# Altium schematic sheet CRSC0004.SchDoc: Critical System Computer - Serial
size A3; Engineer: Sam Shan Jiang; DocumentNumber: CRSC0004; SheetNumber: 4; SheetTotal: 5; Description: Serial USB interface chip; Version: 1.0
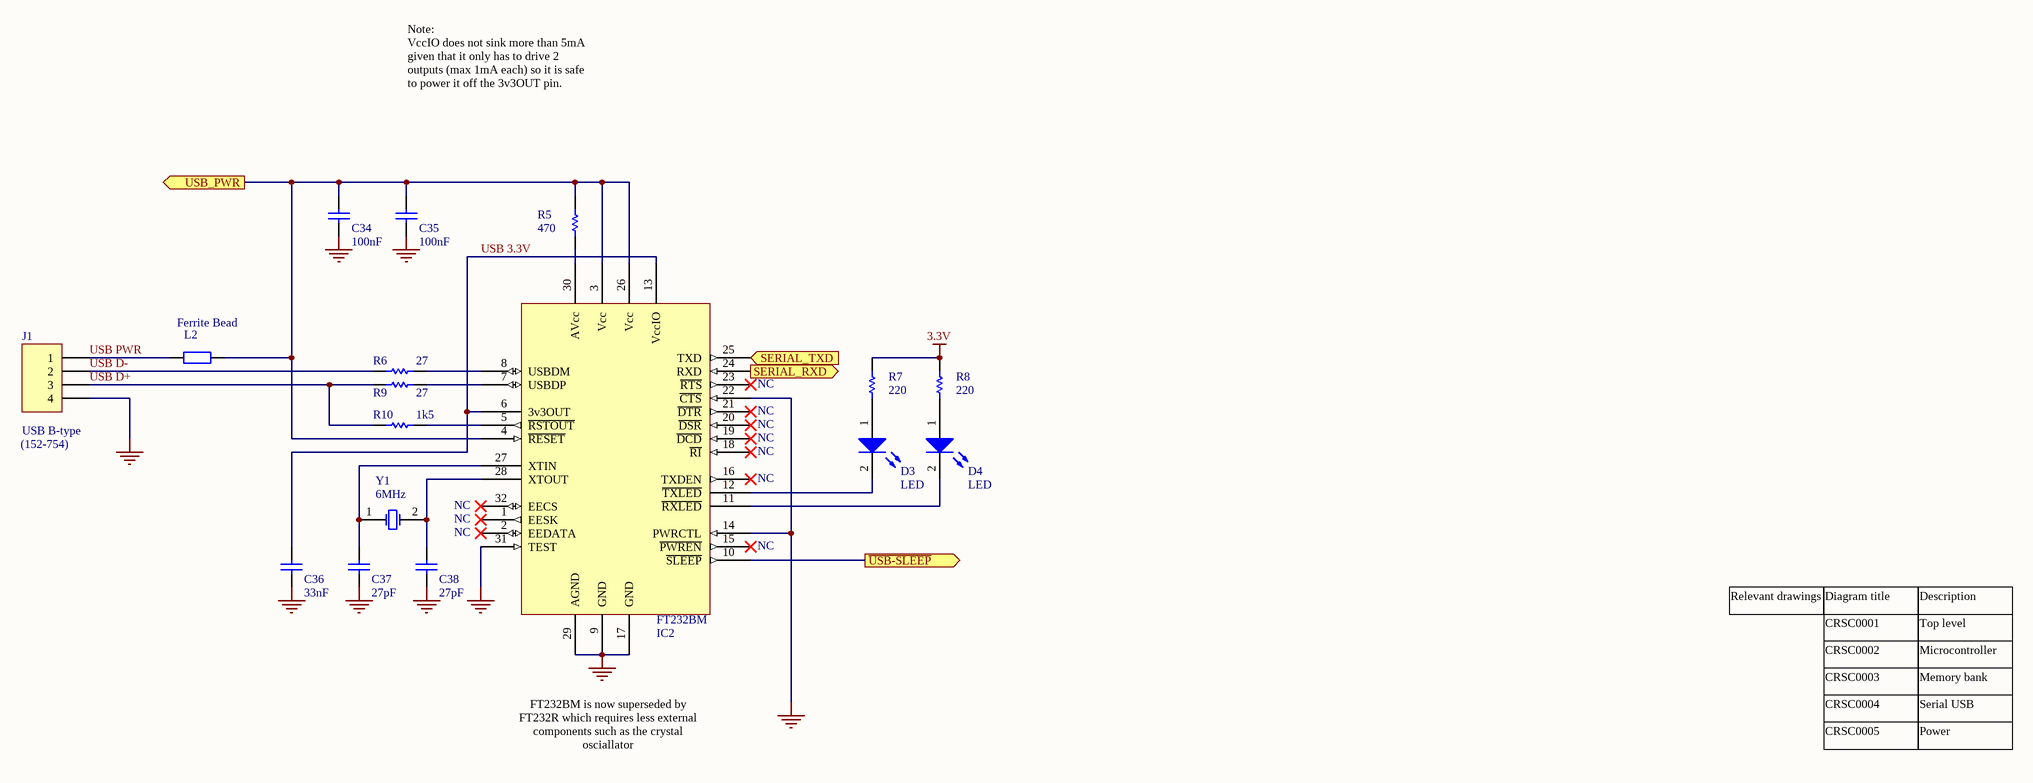
[diagram p0: CRSC0004.SchDoc]

## Parts
C34  100nF  [0805]
C35  100nF  [0805]
C36  33nF  [0805]
C37  27pF  [0805]
C38  27pF  [0805]
D3  LED  [0805]
D4  LED  [0805]
IC2  FT232BM  [FT232BM]
J1  USB B-type  [usb-b]
L2  Ferrite Bead  [AXIAL-0.5]  (value not drawn)
R5  470  [0805]
R6  27  [0805]
R7  220  [0805]
R8  220  [0805]
R9  27  [0805]
R10  1k5  [0805]
Y1  6MHz  [HC49US]

## Ports
SERIAL_RXD (in), SERIAL_TXD (out), USB_PWR (out), ~{USB-SLEEP} (out)

## Nets
3.3V: R7.1 R8.1
GND: C34.2 C35.2 C36.2 C37.2 C38.2 IC2.9(GND) IC2.14(PWRCTL) IC2.17(GND) IC2.22(~{CTS}) IC2.29(AGND) IC2.31(TEST) J1.4
~{USB-SLEEP}: IC2.10(~{SLEEP}) ; port ~{USB-SLEEP}
SERIAL_RXD: IC2.24(RXD) ; port SERIAL_RXD
SERIAL_TXD: IC2.25(TXD) ; port SERIAL_TXD
USB 3.3V: C36.1 IC2.6(3v3OUT) IC2.13(VccIO)
USB D+: J1.3 R9.1 R10.1
USB D-: J1.2 R6.1
USB PWR: J1.1 L2.2
USB_PWR: C34.1 C35.1 IC2.3(Vcc) IC2.4(~{RESET}) IC2.26(Vcc) L2.1 R5.1 ; port USB_PWR
NetC37_1: C37.1 IC2.27(XTIN) Y1.1(OSC1)
NetC38_1: C38.1 IC2.28(XTOUT) Y1.2(OSC2)
NetD3_1: D3.1(A) R7.2
NetD3_2: D3.2(K) IC2.12(~{TXLED})
NetD4_1: D4.1(A) R8.2
NetD4_2: D4.2(K) IC2.11(~{RXLED})
NetIC2_5: IC2.5(~{RSTOUT}) R10.2
NetIC2_7: IC2.7(USBDP) R9.2
NetIC2_8: IC2.8(USBDM) R6.2
NetIC2_30: IC2.30(AVcc) R5.2

Not connected (* = marked no-connect by the designer): IC2 1(EESK)* 2(EEDATA)* 15(~{PWREN})* 16(TXDEN)* 18(~{RI})* 19(~{DCD})* 20(~{DSR})* 21(~{DTR})* 23(~{RTS})* 32(EECS)*

## Notes on the sheet
- Note:
  VccIO does not sink more than 5mA given that it only has to drive 2 outputs (max 1mA each) so it is safe to power it off the 3v3OUT pin.
- (near L2) Ferrite Bead
- (near IC2) NC
- (near J1) (152-754)
- NC
- Relevant drawings
- CRSC0001
- CRSC0002
- Diagram title
- Top level
- Microcontroller
- Description
- CRSC0003
- CRSC0004
- Memory bank
- Serial USB
- FT232BM is now superseded by FT232R which requires less external components such as the crystal osciallator
- CRSC0005
- Power
- Title
- Description:
- Size:
- Author:
- Date:
- A3
- Time:
- Version
- Sheet:
- Drawing No.:
- of
- File:

## Library data of the parts
C34-C38 = Cap Semi: Capacitor (Semiconductor SIM Model); Manufacturer: Generic Components; Class: Passive; Published: 08/06/2000; Publisher: Altium Hobart Technology Centre; SubClass: Capacitor
  C34 C35: Value: 100nF
  C36: Value: 33nF
  C37 C38: Value: 27pF
D3 D4 = LED2: Typical RED, GREEN, YELLOW, AMBER GaAs LED; Manufacturer: Generic Components; Class: Optoelectronic; Published: 08/06/2000; Publisher: Altium Hobart Technology Centre; SubClass: LED
IC2 = FT232BM: FT232BM USB UART (Usb->Serial) IC
J1 = Header 4: Header, 4-Pin; Manufacturer: Generic Components; Class: Connector
L2 = Res2: Manufacturer: Generic Components; Class: Passive; SubClass: Resistor; Value: 1K; Published: 08/06/2000; Publisher: Altium Hobart Technology Centre
R5-R10 = Res1: Resistor; Manufacturer: Generic Components; Class: Passive; Published: 08/06/2000; Publisher: Altium Hobart Technology Centre; SubClass: Resistor
  R5: Value: 470
  R6 R9: Value: 27
  R7 R8: Value: 220
  R10: Value: 1k5
Y1 = XTAL: Crystal Oscillator; Manufacturer: Generic Components; Published: 08/06/2000; Publisher: Altium Hobart Technology Centre; Class: Oscillator; SubClass: Crystal Oscillator